# Altium schematic sheet main.SchDoc: 智能浇花器
size A4; Author: Bert; Revision: v1.0; SheetNumber: 1; SheetTotal: 1; Time: 2018-05-08
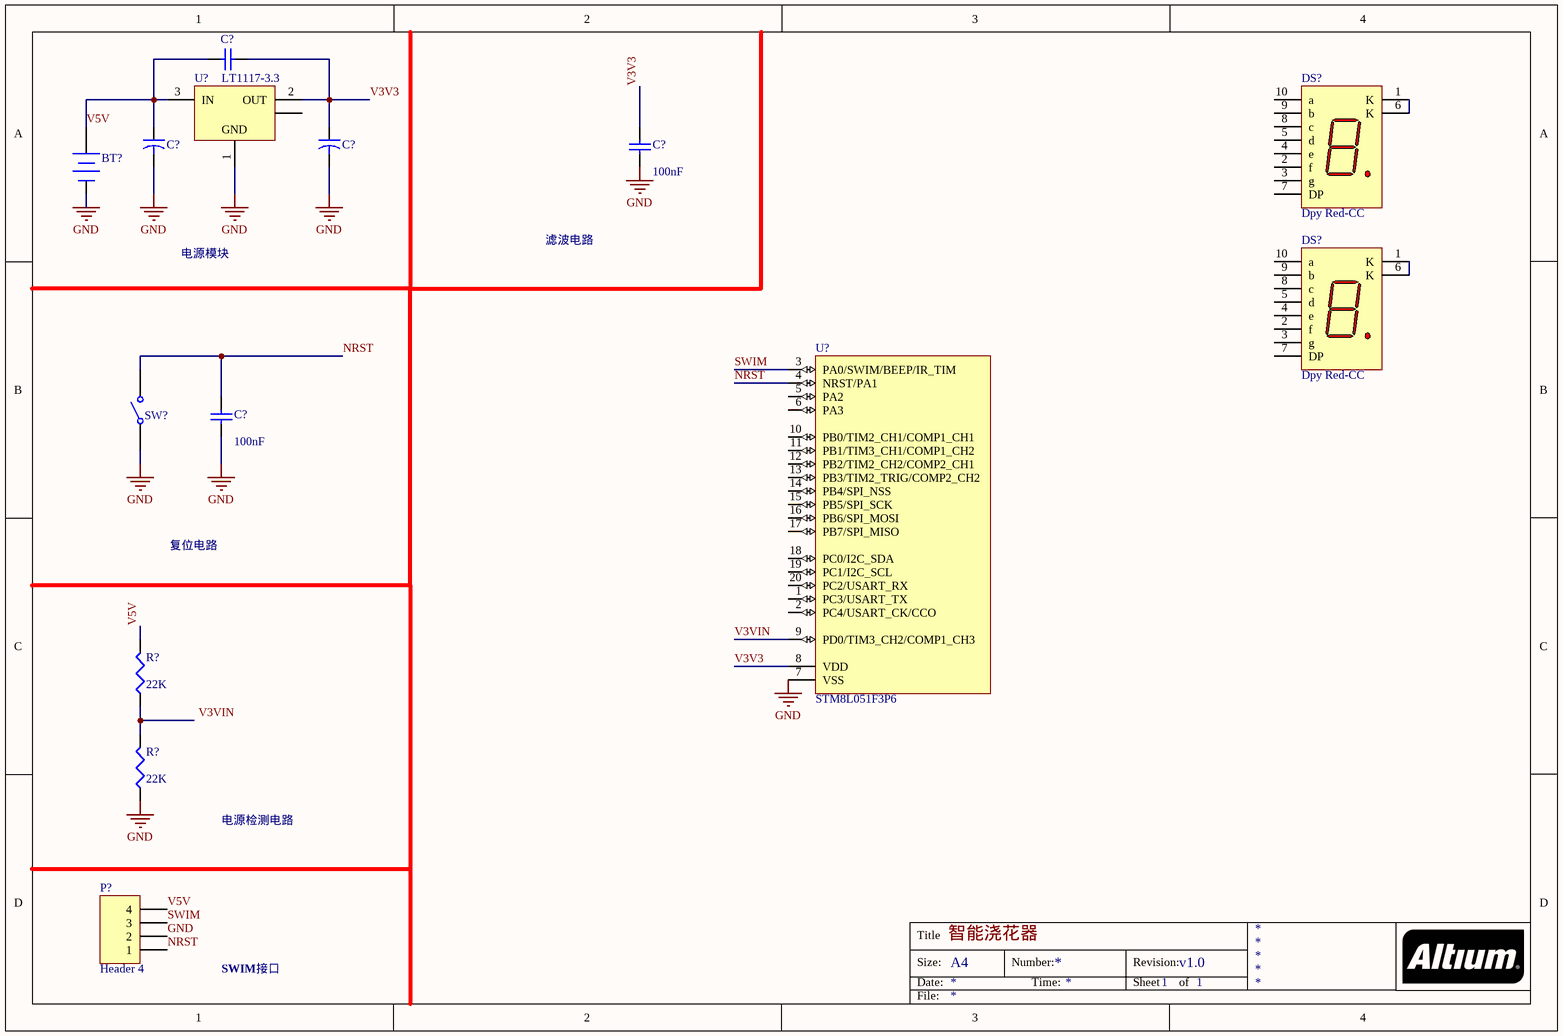
[diagram p0: main.SchDoc]

## Parts
(Parts that share a designator on the sheet are numbered #1, #2 ... from top to bottom, then left to right.)
BT?  Battery  [BAT-2]  (value not drawn)
C?#1  Cap Semi  [C1206]  (value not drawn)
C?#2  Cap2  [CAPR5-4X5]  (value not drawn)
C?#3  Cap2  [CAPR5-4X5]  (value not drawn)
C?#4  value 100nF  [0402]  (hidden comment: Cap Semi)
C?#5  value 100nF  [0402]  (hidden comment: Cap Semi)
DS?#1  Dpy Red-CC  [A]
DS?#2  Dpy Red-CC  [A]
P?  Header 4  [HDR1X4]
R?#1  value 22K  [J1-0603]  (hidden comment: Res3)
R?#2  value 22K  [J1-0603]  (hidden comment: Res3)
SW?  434111043826  [434111043826]  (value not drawn)
U?#1  LT1117-3.3  [LT-ST-3-SOT-223_N]
U?#2  STM8L051F3P6  [TSSOP20_N]

## Nets
GND: BT?.2(-) C?#2.2 C?#3.2 C?#4.1 C?#5.1 P?.2 R?#2.1 SW?.1 U?#1.1(GND) U?#2.7(VSS)
NRST: C?#5.2 P?.1 SW?.2 U?#2.4(NRST/PA1)
SWIM: P?.3 U?#2.3(PA0/SWIM/BEEP/IR_TIM)
V3V3: C?#1.1 C?#3.1 C?#4.2 U?#1.2(OUT) U?#2.8(VDD)
V3VIN: U?#2.9(PD0/TIM3_CH2/COMP1_CH3)
V5V: BT?.1(+) C?#1.2 C?#2.1 P?.4 R?#1.2 U?#1.3(IN)
NetDS?#1_1: DS?#1.1(K) DS?#1.6(K)
NetDS?#2_1: DS?#2.1(K) DS?#2.6(K)
NetR?#1_1: R?#1.1 R?#2.2

Not connected (* = marked no-connect by the designer): DS?#1 2(f) 3(g) 4(e) 5(d) 7(DP) 8(c) 9(b) 10(a); DS?#2 2(f) 3(g) 4(e) 5(d) 7(DP) 8(c) 9(b) 10(a); U?#1 4(VOUT); U?#2 1(PC3/USART_TX) 2(PC4/USART_CK/CCO) 5(PA2) 6(PA3) 10(PB0/TIM2_CH1/COMP1_CH1) 11(PB1/TIM3_CH1/COMP1_CH2) 12(PB2/TIM2_CH2/COMP2_CH1) 13(PB3/TIM2_TRIG/COMP2_CH2) 14(PB4/SPI_NSS) 15(PB5/SPI_SCK) 16(PB6/SPI_MOSI) 17(PB7/SPI_MISO) 18(PC0/I2C_SDA) 19(PC1/I2C_SCL) 20(PC2/USART_RX)

## Notes on the sheet
- 滤波电路
- 电源模块
- 复位电路
- 电源检测电路
- SWIM接口
- Labels drawn without touching a wire or pin: V3VIN
- Title
- Size:
- Date:
- A4
- Number:
- Time:
- Revision:
- Sheet
- of
- File:

## Library data of the parts
BT? = Battery: Multicell Battery; Published: 24-Mar-1999; LatestRevisionDate: 17-Jul-2002; LatestRevisionNote: Re-released for DXP Platform.; PackageReference: BAT-2; Publisher: Altium Limited; PackageDescription: Battery; 2 Leads
C?#1 = Cap Semi: Capacitor (Semiconductor SIM Model); Value: 100pF; Published: 8-Jun-2000; LatestRevisionDate: 29-May-2009; LatestRevisionNote: IPC-7351 Footprint Added.; PackageReference: C1206; Publisher: Altium Limited; PackageDescription: Chip Capacitor
C?#2 C?#3 = Cap2: Capacitor; Value: 10uF; Published: 23-Sep-2002; PackageReference: CAPR5-4X5; Publisher: Altium Limited; PackageDescription: Capacitor; 2 Leads
C?#4 C?#5 = Cap Semi: Capacitor (Semiconductor SIM Model); Published: 8-Jun-2000; LatestRevisionDate: 29-May-2009; LatestRevisionNote: IPC-7351 Footprint Added.; PackageReference: C1206; Publisher: Altium Limited; PackageDescription: Chip Capacitor
DS?#1 DS?#2 = Dpy Red-CC: 7.62 mm Black Surface HER 7-Segment Display: CC, RH DP; MinimumIntensity: 360 ucd; Note: IF = 5 mA; Colour: High Efficiency Red (HER); Note: Pins 1 and 6 are redundant Cathodes.; Published: 8-Jun-2000; LatestRevisionDate: 17-Dec-2003; LatestRevisionNote: Schematic revised, PCB Footprint replaced.; DatasheetVersion: 19-Feb-2002; PackageVersion: 11-Feb-2002; PackageReference: A; Publisher: Altium Limited; PackageDescription: LED, 7-Segment Display, 7.62 mm, RHD; 10 Leads; Row Space 5.08 mm; Pitch 2.54 mm; ComponentLink1Description: Manufacturer Link; ComponentLink1URL: http://www.agilent.com/
P? = Header 4: Header, 4-Pin; LatestRevisionDate: 17-Jul-2002; LatestRevisionNote: Re-released for DXP Platform.; Publisher: Altium Limited
R?#1 R?#2 = Res3: Resistor; Published: 8-Jun-2000; LatestRevisionDate: 29-May-2009; LatestRevisionNote: IPC-7351 Footprint Added.; PackageReference: J1-0603; Publisher: Altium Limited; PackageDescription: Chip Resistor
SW? = 434111043826: WS-TASV SMD Tact Switch 6.0X3.5 mm; NoPins: 02; PackageReference: 434111043826; PartNumber: 434111043826; ComponentLink1Description: Manufacturer URL; ComponentLink1URL: http://www.we-online.com; ComponentLink2Description: Datasheet; ComponentLink2URL: http://katalog.we-online.de/em/datasheet/434111043826.pdf
U?#1 = LT1117CST-3.3#TRPBF: 0.8 A Low Dropout Positive Regulator, 2.45 to 15 V Vin, 3.3 V Vout, 3-pin SOT223 (ST-3), 0 to 125 degC, Pb-Free, Tape and Reel; Manufacturer: Linear Technology; Discrete Pass Element: no; Dropout Voltage(V): 1.1; Iout(mA): 800; Isupply(mA): 5; Number of Outputs: 1; Output Voltage: 3.3 V; PSRR(dB): 75; Vin Max(V): 15; Vin Min(V): 2.45; DatasheetVersion: Rev. D; PackageVersion: Jun-10; PackageReference: ST-3; PackageDescription: 3-Pin Plastic SOT-223, 3.505 x 6.505 mm Body, Pitch 2.3 mm; Supplier 1: Digi-Key; Supplier Part Number 1: LT1117CST-3.3#TRPBF-ND; Supplier 2: Newark; Supplier Part Number 2: 57M1800; Packing: Tape and Reel; RoHS: TRUE; Mounting Technology: Surface Mount; PartNumber: LT1117CST-3.3#TRPBF; ComponentLink1Description: Manufacturer URL; ComponentLink1URL: http://www.linear.com/; ComponentLink2Description: Datasheet; ComponentLink2URL: http://cds.linear.com/docs/en/datasheet/1117fd.pdf; ComponentLink3Description: Package Specification; ComponentLink3URL: http://cds.linear.com/docs/en/packaging/SOT_3_05-08-1630.pdf
U?#2 = STM8L101F3P6: STM8L ARM-based EnergyLite 8-bit MCU, 8 kB Flash, 1.5 kB Internal RAM, -40 to +85癈 Temperature, 20-pin TSSOP, Tube; PackageVersion: 2010; PackageReference: TSSOP20; PackageDescription: 20-Pin Thin Shrink Small Package Outline 0.65 mm Pitch; ComponentLink1Description: Manufacturer URL; ComponentLink1URL: http://www.st.com/; ComponentLink2Description: STM8L101 Datasheet; ComponentLink2URL: http://www.st.com/internet/com/TECHNICAL_RESOURCES/TECHNICAL_LITERATURE/DATASHEET/CD00220591.pdf; ComponentLink3Description: STM8L Family Web Page; ComponentLink3URL: http://www.st.com/internet/mcu/subclass/1381.jsp